# EasyEDA Pro project ProProject_PCB_PCB_小移动电源_2024-09-28_2024-12-17.epro

# Board PCB3
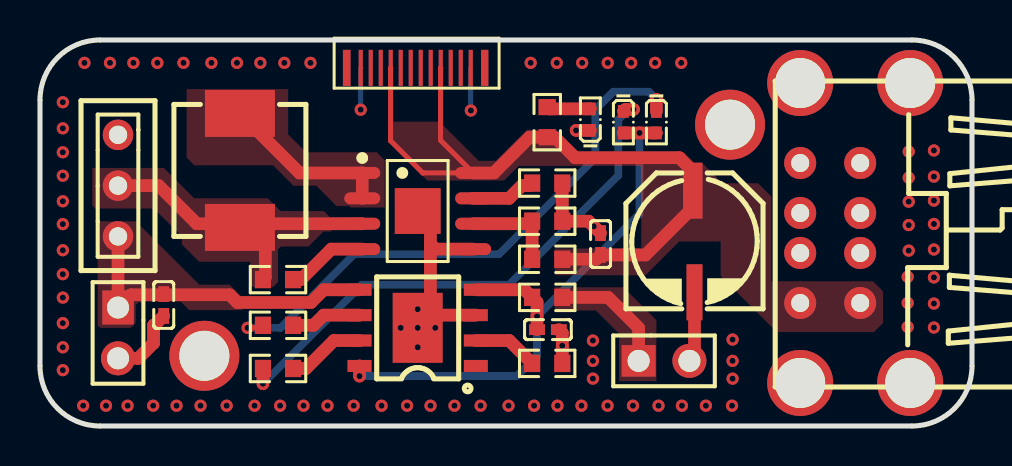
[diagram p0: board, top side]
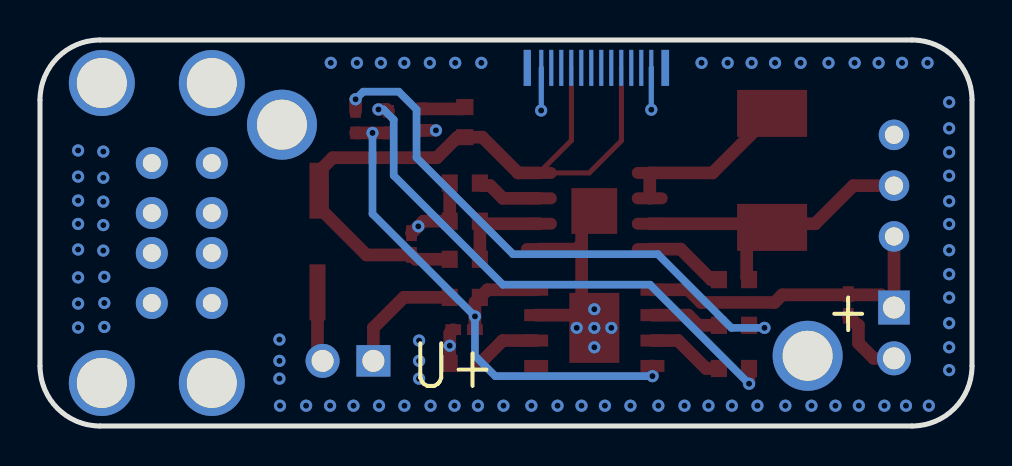
[diagram p1: board, bottom side, seen from below]

Outline 46.61 x 19.3 mm; copper layers: Top Layer, Bottom Layer. Coordinates in mm from the lower left corner of the outline.
Outline path: 0,16.3 0,3 arc(0.88,0.88) 3,0 43.61,0 arc(45.73,0.88) 46.61,3 46.61,16.3 arc(45.73,18.43) 43.61,19.3 3,19.3 arc(0.88,18.43) 0,16.3
Stack: Top Layer 0.035mm / Dielectric1 1.51mm FR4 er 4.5 / Bottom Layer 0.035mm

## Design rules (mm)
template: 自定义配置
spacing copperThickness1oz (default): track to track 0.102, other pairs 0.152 to 0.3
spacing copperThickness2oz: track to track 0.203, other pairs 0.152 to 0.3
track width copperThickness1oz (default): min 0.127, default 0.254, max 2.54
track width copperThickness2oz: min 0.203, default 0.254, max 2.54
differential pair differentialPair (default): width min 0.127, default 0.254, max 2.54; gap min 0.152, default 0.152
via viaSize (default): diameter min 0.5, default 0.61, max 10; hole min 0.3, default 0.305, max 6.299

## Placement (name value [footprint] x y rotation side)
C9  100uf  [CAP-D6.3×H5.5]  32.73 6.69 90 top
C10  22uf  [C0402]  28.03 9.1 270 top
C24  10U  [C0402]  25.4 4.82 180 top
C25  10U  [C0402]  6.19 6.05 270 top
ENABLE1  -  [SS-12D00-G4]  3.9 12.02 90 top
J1  HDR-M-2.54_1x2  [HDR-M-2.54_1X2]  3.9 4.65 270 top
J2  HDR-M-2.54_1x2  [HDR-M-2.54_1X2]  31.21 3.26 0 top
L2  3.3uH  [IND-SMD_L7.2-W6.6_GPSR07X0]  10 12.78 90 top
NOREF  -  [Pad_e117]  8.22 3.51 0 top
NOREF#2  -  [Pad_e109]  34.51 15.07 0 top
R1  0  [R0603]  25.36 6.43 0 top
R2  1k  [R0603]  11.9 5.04 180 top
R3  1k  [R0603]  11.9 2.88 180 top
R4  1k  [R0603]  25.36 3.13 180 top
R5  2k  [R0603]  25.36 15.2 270 top
R8  10k  [R0603]  11.9 7.32 0 top
R9  43k  [R0603]  25.36 12.15 0 top
R10  10k  [R0603]  25.36 10.24 180 top
R11  73k  [R0603]  25.36 8.34 0 top
U1  -  [TYPE-C 公头 夹板]  18.52 17.91 90 top
U2  双层USB母座 COPY  [双层USB母座]  40.77 9.65 90 top
U3  GBG-C281TBKT  [LED0402-RD]  29.17 15.2 270 top
U4  GBG-C281TBKT  [LED0402-RD]  30.83 15.2 270 top
U5  FP6276BXR-G1  [SOP-8_L4.9-W3.9-P1.27-LS6.0-BL-EP]  18.89 10.75 270 top
U6  GBG-C281TBKT  [LED0402-RD]  27.52 15.32 90 top
U11  TP4056  [ESOP-8_L4.9-W3.9-P1.27-LS6.0-BL-EP]  18.89 4.91 90 top

## Footprints (pads in the part's own frame, mm; a bottom-side part is the same pattern mirrored in y, then rotated)
C0402
  rect 0.79x0.54 smd: 1(-0.545,0) 2(0.545,0)
CAP-D6.3×H5.5
  rect 2.8x0.8 smd: 1(5.08,0) 2(0,0)
ESOP-8_L4.9-W3.9-P1.27-LS6.0-BL-EP
  rect 0.6x1.2 smd: 1(-1.905,-2.909) 2(-0.635,-2.909) 3(0.635,-2.909) 4(1.905,-2.909) 5(1.905,2.909) 6(0.635,2.909) 7(-0.635,2.909) 8(-1.905,2.909)
  rect 3.5x2.5 smd: 9(0,0)
HDR-M-2.54_1X2
  rect 1.7x1.575 hole 1.1: 1(-1.27,0)
  round 1.7 hole 1.1: 2(1.27,0)
IND-SMD_L7.2-W6.6_GPSR07X0
  rect 2.35x3.5 smd: 1(-2.85,0) 2(2.85,0)
LED0402-RD
  rect 0.636x0.54 smd: 1(-0.538,0) 2(0.538,0)
Pad_e109
  round 3.5 hole 2.5: 1(0,0)
Pad_e117
  round 3.5 hole 2.5: 1(0,0)
R0603
  rect 0.806x0.864 smd: 1(-0.753,0) 2(0.753,0)
SOP-8_L4.9-W3.9-P1.27-LS6.0-BL-EP
  oval 0.6x1.8 smd: 1(-1.905,-2.772) 2(-0.635,-2.772) 3(0.635,-2.772) 4(1.905,-2.772) 5(1.905,2.772) 6(0.635,2.772) 7(-0.635,2.772) 8(-1.905,2.772)
  rect 2.29x2.29 smd: 9(0,0)
SS-12D00-G4
  round 1.524 hole 0.914: 1(-2.54,0) 2(0,0) 3(2.54,0)
TYPE-C 公头 夹板
  rect 1.8x0.36 smd far side: 0(0,-3.725)
  rect 1.8x0.38 smd far side: 1(0,3.175)
  rect 1.8x0.36 smd: 2(0,-3.725)
  rect 1.8x0.38 smd: 3(0,3.175)
  rect 1.8x0.2 smd: A1(0,2.475) A2(0,1.975) A3(0,1.475) A4(0,0.975) A5(0,0.475) A6(0,-0.025) A7(0,-0.525) A8(0,-1.025) A9(0,-1.525) A10(0,-2.025) A11(0,-2.525) A12(0,-3.025)
  rect 1.8x0.2 smd far side: B1(0,-3.025) B2(0,-2.525) B3(0,-2.025) B4(0,-1.525) B5(0,-1.025) B6(0,-0.525) B7(0,-0.025) B8(0,0.475) B9(0,0.975) B10(0,1.475) B11(0,1.975) B12(0,2.475)
双层USB母座
  round 1.6 hole 0.9: 1(-3.5,2.75) 2(-3.5,-0.25) 3(3.5,2.75) 4(3.5,-0.25) 5(1,2.75) 6(-1,2.75) 7(1,-0.25) 8(-1,-0.25)
  round 3.3 hole 2.5: 9(-7.5,2.75) 10(7.5,2.75) 11(-7.5,-2.75) 12(7.5,-2.75)

## Nets
+5V: C9.1 C10.2 R5.2 R11.2 U1.A4 U1.A9 U1.B4 U1.B9 U2.1 U2.2 U5.8
GND: C9.2 C10.1 C24.1 C25.2 J1.2 J2.2 R4.1 R9.2 R10.1 U1.A1 U1.A12 U1.B1 U1.B12 U2.3 U2.4 U2.9 U2.10 U2.11 U2.12 U5.5 U5.9 U6.1 U11.1 U11.3 U11.9
VBUS: J2.1 R1.2
BAT: C25.1 ENABLE1.1 J1.1 U11.5
BAT-O: ENABLE1.2 L2.1 R8.1 U5.3
L2_2: L2.2 U5.1 U5.2
U3_1: R3.2 U3.1
U4_1: R2.2 U4.1
U4_2: C24.2 R1.1 U3.2 U4.2 U11.4 U11.8
U5_4: R8.2 U5.4
U5_6: R10.2 R11.1 U5.6
U5_7: R9.1 U5.7
U6_2: R5.1 U6.2
U11_2: R4.2 U11.2
U11_6: R2.1 U11.6
U11_7: R3.1 U11.7

Pads without a net: ENABLE1 3; NOREF 1; NOREF#2 1; U1 0 1 2 3 A2 A3 A5 A6 A7 A8 A10 A11 B2 B3 B5 B6 B7 B8 B10 B11; U2 5 6 7 8

## Via types
v1: diameter 0.61, hole 0.305, Top Layer to Bottom Layer, 95 vias

## Routing (per net, layer and track width the routed paths; a pad name or vN(x,y) marks a point on that pad's centre or on a via; arc(x,y) is an arc through that point)
+5V: length 36.3
  Top Layer w0.254: U1.A9 20.03,17.9 20.03,14.28 U5.8 19.14,12.66 17.53,14.27 17.53,17.9 U1.A4
  Top Layer w0.635: 32.48,11.77 C9.1 ; 32.48,11.77 32.48,12.91 31.97,13.42 26.76,13.42 25.74,14.44 R5.2 24.48,14.44 22.7,12.66 U5.8 ; 32.48,11.77 32.48,10.75 30.28,8.55 C10.2 27.82,8.34 R11.2
GND: length 28.3
  Top Layer w0.635: 32.48,3.26 32.73,3.51 C9.2 ; C10.1 v1(27.69,9.98) 27.43,10.24 R10.1 R9.2 ; 19.39,10.25 19.52,10.11 19.52,9.1 ; 19.52,9.1 19.78,8.85 U5.5 ; 19.52,9.1 19.52,5.54 ; 19.52,5.54 v1(18.89,4.91) ; 19.52,5.54 U11.3 ; J1.2 4.92,3.38 5.68,4.15 5.68,5.04 5.72,5.04 C25.2 ; U6.1 v1(26.81,14.78) ; C24.1 26.12,4.65 v1(26.12,4.01) R4.1
  Bottom Layer w0.254: U1.A1 16.04,17.91 v1(16.04,15.82) ; U1.A12 21.54,15.71 21.55,15.72 v1(21.55,15.78)
  vias: v1(1.14,16.19) v1(1.14,14.89) v1(1.14,13.69) v1(1.14,12.52) v1(1.14,11.24) v1(1.14,10.1) v1(1.14,8.79) v1(1.14,7.59) v1(1.14,6.42) v1(1.14,5.14) v1(1.14,3.94) v1(1.14,2.79) v1(2.22,18.16) v1(2.16,1.02) v1(3.3,1.02) v1(3.5,18.16) v1(4.38,1.02) v1(4.67,18.16) v1(5.66,1.02) v1(5.87,18.16) v1(6.83,1.02) v1(7.18,18.16) v1(8.03,1.02) v1(8.57,18.16) v1(9.33,1.02) v1(9.85,18.16) v1(10.73,1.02) v1(11.02,18.16) v1(12.01,1.02) v1(12.22,18.16) v1(13.18,1.02) v1(13.53,18.16) v1(14.38,1.02) v1(15.68,1.02) v1(17.08,1.02) v1(18.04,4.91) v1(18.36,1.02) v1(18.89,5.84) v1(18.89,3.94) v1(19.53,1.02) v1(19.77,4.91) v1(20.73,1.02) v1(22.03,1.02) v1(23.43,1.02) v1(24.54,18.16) v1(24.71,1.02) v1(25.84,18.16) v1(25.88,1.02) v1(27.11,18.16) v1(27.08,1.02) v1(27.65,4.27) v1(27.65,3.26) v1(27.65,2.37) v1(28.39,18.16) v1(28.38,1.02) v1(29.56,18.16) v1(29.65,1.02) v1(30.76,18.16) v1(30.93,1.02) v1(32.07,18.16) v1(32.1,1.02) v1(33.3,1.02) v1(34.64,4.32) v1(34.64,3.26) v1(34.64,2.37) v1(34.61,1.02) v1(43.44,13.72) v1(43.44,12.42) v1(43.44,11.22) v1(43.44,10.05) v1(43.44,8.77) v1(43.39,7.46) v1(43.39,6.15) v1(43.39,4.95) v1(44.7,13.78) v1(44.7,12.47) v1(44.7,11.27) v1(44.7,10.1) v1(44.7,8.83) v1(44.7,7.43) v1(44.7,6.12) v1(44.7,4.92)
VBUS: length 6.1
  Top Layer w0.635: J2.1 29.94,4.91 28.41,6.43 R1.2
BAT: length 16.3
  Top Layer w0.635: U11.5 14.19,6.81 13.55,6.18 9.87,6.18 9.49,6.56 4.54,6.56 J1.1 ENABLE1.1
BAT-O: length 15.9
  Top Layer w0.635: U5.3 10.18,10.12 ; 10.18,10.12 L2.1 ; 10.18,10.12 7.84,10.12 5.93,12.02 ENABLE1.2 ; R8.1 11.27,7.44 11.27,9.86
L2_2: length 8.6
  Top Layer w0.635: U5.2 U5.1 12.98,12.66 L2.2
U3_1: length 27.2
  Top Layer w0.254: R3.2 11.15,2.67
  Top Layer w0.635: v1(29.68,15.83) 29.27,15.83 U3.1 ; 11.15,2.67 v1(11.15,2.11)
  Bottom Layer w0.381: v1(11.15,2.11) 16.1,7.07 23.46,7.07 28.92,12.53 28.92,15.32 29.43,15.83 v1(29.68,15.83)
U4_1: length 28.3
  Top Layer w0.254: v1(10.38,4.91) 11.02,4.91 R2.2
  Top Layer w0.635: U4.1 v1(30.83,16.34)
  Bottom Layer w0.381: v1(10.38,4.91) 12.03,4.91 15.71,8.59 22.95,8.59 27.78,13.42 27.78,15.83 28.67,16.72 30.45,16.72 v1(30.83,16.34)
U4_2: length 29.4
  Top Layer w0.635: C24.2 v1(24.86,5.48) 24.86,6.19 R1.1 24.23,6.81 U11.4 ; U3.2 v1(29.98,14.66) U4.2 ; U11.8 v1(15.98,2.5)
  Bottom Layer w0.381: v1(15.98,2.5) 23.84,2.5 24.86,3.51 v1(24.86,5.48) 29.98,10.61 v1(29.98,14.66)
U5_4: length 4.1
  Top Layer w0.635: U5.4 14.57,8.85 13.05,7.32 R8.2
U5_6: length 4.9
  Top Layer w0.635: R11.1 R10.2 24.48,10.12 U5.6
U5_7: length 3.3
  Top Layer w0.635: U5.7 23.46,11.39 24.1,12.02 24.48,12.02 R9.1
U6_2: length 2.2
  Top Layer w0.635: 25.36,15.95 25.45,15.86 U6.2
U11_2: length 3.3
  Top Layer w0.635: U11.2 23.47,4.27 R4.2
U11_6: length 3.5
  Top Layer w0.635: R2.1 13.68,5.04 14.19,5.54 U11.6
U11_7: length 3.9
  Top Layer w0.635: R3.1 13.3,2.88 14.7,4.27 U11.7

## Copper pours and planes (outline as drawn; the poured copper is in the pictures)
+5V on Top Layer: 33.36,12.14 42.16,12.14 42.16,4.7 33.36,4.7
+5V on Top Layer: 17.44,15.22 34,15.22 34,7.54 17.44,7.54
GND on Top Layer: -4.06,24.26 49.78,24.26 49.78,-3.81 -4.06,-3.81
GND on Bottom Layer: -3.43,22.1 48.64,22.1 48.64,-3.81 -3.43,-3.81
VBUS on Top Layer: 25.75,6.94 30.83,6.94 30.83,2.24 25.75,2.24
BAT on Top Layer: 2.89,10.24 10.13,10.24 10.13,4.91 2.89,4.91
BAT-O on Top Layer: 2.62,12.91 14.57,12.91 14.57,6.94 2.62,6.94
L2_2 on Top Layer: 7.33,16.85 17.24,16.85 17.24,10.92 7.33,10.92

## Text on the board
Bottom Silkscreen Layer: + | U+

# Board PCB2
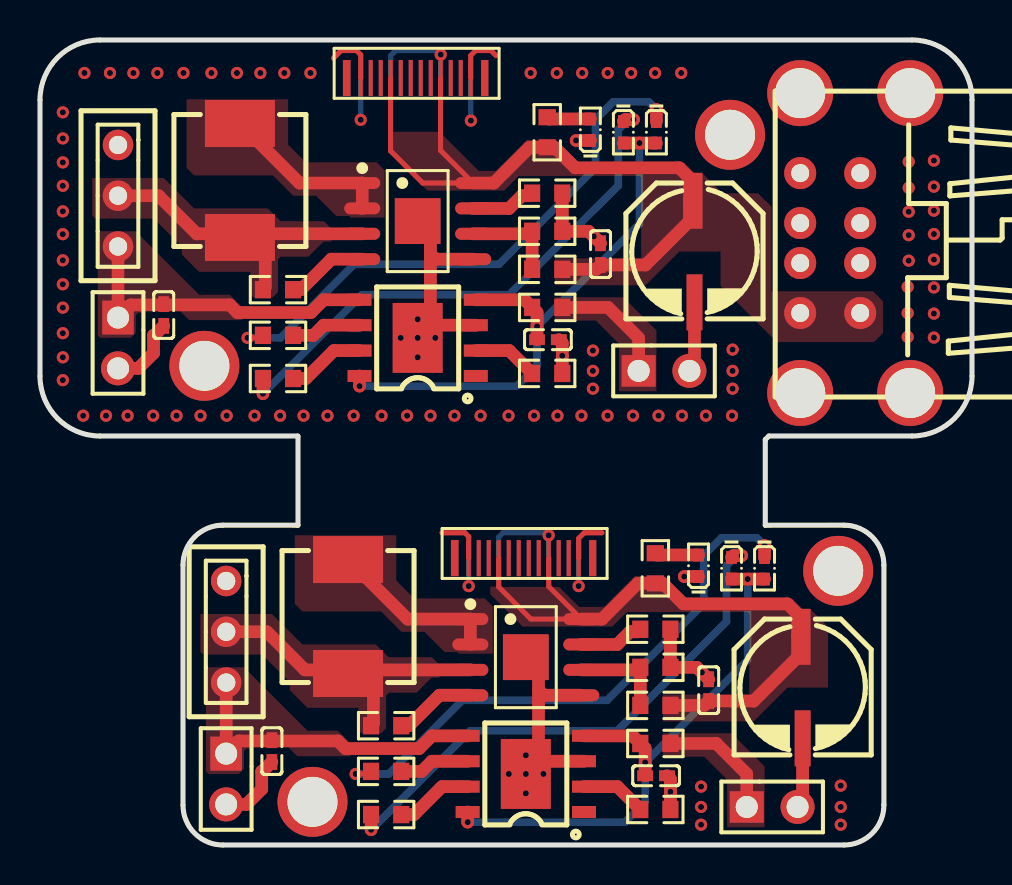
[diagram p2: board, top side]
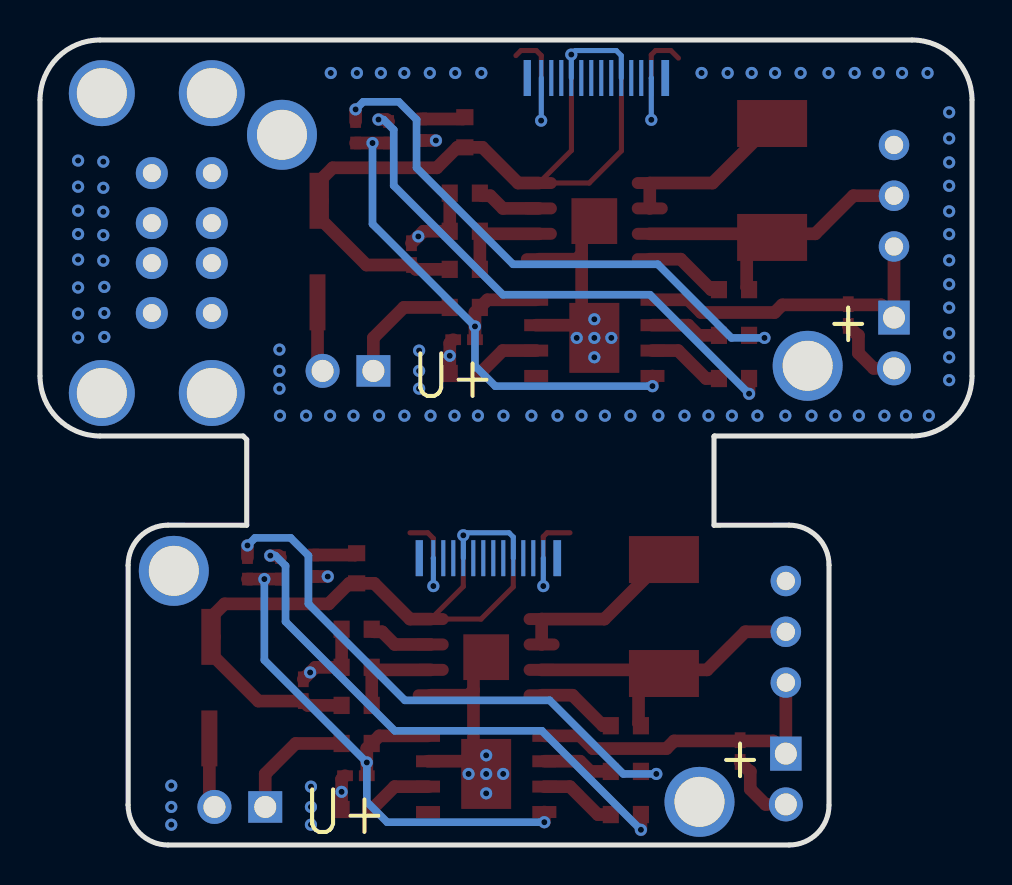
[diagram p3: board, bottom side, seen from below]

Outline 46.61 x 40.27 mm; copper layers: Top Layer, Bottom Layer. Coordinates in mm from the lower left corner of the outline.
Outline path: 0,37.27 0,23.46 arc(0.88,21.34) 3,20.46 12.88,20.46 12.9,20.44 12.9,16 9.15,16 arc(7.74,15.42) 7.15,14 7.15,2 arc(7.74,0.59) 9.15,0 40.2,0 arc(41.62,0.59) 42.2,2 42.2,14 arc(41.62,15.42) 40.2,16 36.27,16 36.27,20.28 36.45,20.46 43.61,20.46 arc(45.73,21.34) 46.61,23.46 46.61,37.27 arc(45.73,39.4) 43.61,40.27 3,40.27 arc(0.88,39.4) 0,37.27
Stack: Top Layer 0.035mm / Dielectric1 1.51mm FR4 er 4.5 / Bottom Layer 0.035mm

## Design rules (mm)
template: JLCPCB Capability(Two Layers Board)
spacing copperThickness1oz (default): track to track 0.102, other pairs 0.152 to 0.3
spacing copperThickness2oz: track to track 0.203, other pairs 0.152 to 0.3
track width copperThickness1oz (default): min 0.127, default 0.254, max 2.54
track width copperThickness2oz: min 0.203, default 0.254, max 2.54
differential pair differentialPair (default): width min 0.127, default 0.254, max 2.54; gap min 0.152, default 0.152
via viaSize (default): diameter min 0.5, default 0.61, max 10; hole min 0.3, default 0.305, max 6.3

## Placement (name value [footprint] x y rotation side)
C9  -  [CAP-D6.3×H5.5]  38.14 5.33 90 top
C9#2  -  [CAP-D6.3×H5.5]  32.73 27.15 90 top
C10  -  [C0402]  28.03 29.56 270 top
C10#2  -  [C0402]  33.44 7.75 270 top
C24  -  [C0402]  30.81 3.47 180 top
C24#2  -  [C0402]  25.4 25.28 180 top
C25  -  [C0402]  11.6 4.7 270 top
C25#2  -  [C0402]  6.19 26.51 270 top
ENABLE1  -  [SS-12D00-G4]  9.31 10.67 90 top
ENABLE1#2  -  [SS-12D00-G4]  3.9 32.48 90 top
J1  -  [HDR-M-2.54_1X2]  9.31 3.3 270 top
J1#2  -  [HDR-M-2.54_1X2]  3.9 25.12 270 top
J2  -  [HDR-M-2.54_1X2]  36.61 1.91 0 top
J2#2  -  [HDR-M-2.54_1X2]  31.21 23.72 0 top
L2  -  [IND-SMD_L7.2-W6.6_GPSR07X0]  15.41 11.43 90 top
L2#2  -  [IND-SMD_L7.2-W6.6_GPSR07X0]  10 33.24 90 top
NOREF  -  [Pad_e1738]  39.92 13.72 0 top
NOREF#2  -  [Pad_e976]  8.22 23.97 0 top
NOREF#3  -  [Pad_e1572]  13.63 2.16 0 top
NOREF#4  -  [Pad_e863]  34.51 35.53 0 top
R1  -  [R0603]  30.77 5.08 0 top
R1#2  -  [R0603]  25.36 26.89 0 top
R2  -  [R0603]  17.31 3.68 180 top
R2#2  -  [R0603]  11.9 25.5 180 top
R3  -  [R0603]  17.31 1.52 180 top
R3#2  -  [R0603]  11.9 23.34 180 top
R4  -  [R0603]  30.77 1.78 180 top
R4#2  -  [R0603]  25.36 23.59 180 top
R5  -  [R0603]  30.77 13.84 270 top
R5#2  -  [R0603]  25.36 35.66 270 top
R8  -  [R0603]  17.31 5.97 0 top
R8#2  -  [R0603]  11.9 27.78 0 top
R9  -  [R0603]  30.77 10.8 0 top
R9#2  -  [R0603]  25.36 32.61 0 top
R10  -  [R0603]  30.77 8.89 180 top
R10#2  -  [R0603]  25.36 30.7 180 top
R11  -  [R0603]  30.77 6.99 0 top
R11#2  -  [R0603]  25.36 28.8 0 top
U1  -  [TYPE-C 公头 夹板]  23.91 14.35 90 top
U1#2  -  [TYPE-C 公头 夹板]  18.51 38.37 90 top
U2  双层USB母座 COPY  [双层USB母座]  40.77 30.11 90 top
U3  -  [LED0402-RD]  34.58 13.84 270 top
U3#2  -  [LED0402-RD]  29.17 35.66 270 top
U4  -  [LED0402-RD]  36.23 13.84 270 top
U4#2  -  [LED0402-RD]  30.83 35.66 270 top
U5  -  [SOP-8_L4.9-W3.9-P1.27-LS6.0-BL-EP]  24.3 9.4 270 top
U5#2  -  [SOP-8_L4.9-W3.9-P1.27-LS6.0-BL-EP]  18.89 31.21 270 top
U6  -  [LED0402-RD]  32.93 13.97 90 top
U6#2  -  [LED0402-RD]  27.52 35.78 90 top
U11  -  [ESOP-8_L4.9-W3.9-P1.27-LS6.0-BL-EP]  24.3 3.56 90 top
U11#2  -  [ESOP-8_L4.9-W3.9-P1.27-LS6.0-BL-EP]  18.89 25.37 90 top

## Footprints (pads in the part's own frame, mm; a bottom-side part is the same pattern mirrored in y, then rotated)
C0402
  rect 0.79x0.54 smd: 1(-0.545,0) 2(0.545,0)
CAP-D6.3×H5.5
  rect 2.8x0.8 smd: 1(5.08,0) 2(0,0)
ESOP-8_L4.9-W3.9-P1.27-LS6.0-BL-EP
  rect 0.6x1.2 smd: 1(-1.905,-2.909) 2(-0.635,-2.909) 3(0.635,-2.909) 4(1.905,-2.909) 5(1.905,2.909) 6(0.635,2.909) 7(-0.635,2.909) 8(-1.905,2.909)
  rect 3.5x2.5 smd: 9(0,0)
HDR-M-2.54_1X2
  rect 1.7x1.575 hole 1.1: 1(-1.27,0)
  round 1.7 hole 1.1: 2(1.27,0)
IND-SMD_L7.2-W6.6_GPSR07X0
  rect 2.35x3.5 smd: 1(-2.85,0) 2(2.85,0)
LED0402-RD
  rect 0.636x0.54 smd: 1(-0.538,0) 2(0.538,0)
Pad_e863
  round 3.5 hole 2.5: 1(0,0)
Pad_e976
  round 3.5 hole 2.5: 1(0,0)
Pad_e1572
  round 3.5 hole 2.5: 1(0,0)
Pad_e1738
  round 3.5 hole 2.5: 1(0,0)
R0603
  rect 0.806x0.864 smd: 1(-0.753,0) 2(0.753,0)
SOP-8_L4.9-W3.9-P1.27-LS6.0-BL-EP
  oval 0.6x1.8 smd: 1(-1.905,-2.772) 2(-0.635,-2.772) 3(0.635,-2.772) 4(1.905,-2.772) 5(1.905,2.772) 6(0.635,2.772) 7(-0.635,2.772) 8(-1.905,2.772)
  rect 2.29x2.29 smd: 9(0,0)
SS-12D00-G4
  round 1.524 hole 0.914: 1(-2.54,0) 2(0,0) 3(2.54,0)
TYPE-C 公头 夹板
  rect 1.8x0.36 smd far side: 0(0,-3.725)
  rect 1.8x0.38 smd far side: 1(0,3.175)
  rect 1.8x0.36 smd: 2(0,-3.725)
  rect 1.8x0.38 smd: 3(0,3.175)
  rect 1.8x0.2 smd: A1(0,2.475) A2(0,1.975) A3(0,1.475) A4(0,0.975) A5(0,0.475) A6(0,-0.025) A7(0,-0.525) A8(0,-1.025) A9(0,-1.525) A10(0,-2.025) A11(0,-2.525) A12(0,-3.025)
  rect 1.8x0.2 smd far side: B1(0,-3.025) B2(0,-2.525) B3(0,-2.025) B4(0,-1.525) B5(0,-1.025) B6(0,-0.525) B7(0,-0.025) B8(0,0.475) B9(0,0.975) B10(0,1.475) B11(0,1.975) B12(0,2.475)
双层USB母座
  round 1.6 hole 0.9: 1(-3.5,2.75) 2(-3.5,-0.25) 3(3.5,2.75) 4(3.5,-0.25) 5(1,2.75) 6(-1,2.75) 7(1,-0.25) 8(-1,-0.25)
  round 3.3 hole 2.5: 9(-7.5,2.75) 10(7.5,2.75) 11(-7.5,-2.75) 12(7.5,-2.75)

## Nets
+5V: C9.1 C9#2.1 C10.2 C10#2.2 R5.2 R5#2.2 R11.2 R11#2.2 U1.A4 U1.A9 U1.B4 U1.B9 U1#2.A4 U1#2.A9 U1#2.B4 U1#2.B9 U2.1 U2.2 U5.8 U5#2.8
GND: C9.2 C9#2.2 C10.1 C10#2.1 C24.1 C24#2.1 C25.2 C25#2.2 J1.2 J1#2.2 J2.2 J2#2.2 R4.1 R4#2.1 R9.2 R9#2.2 R10.1 R10#2.1 U1.A1 U1.A12 U1.B1 U1.B12 U1#2.A1 U1#2.A12 U1#2.B1 U1#2.B12 U2.3 U2.4 U2.9 U2.10 U2.11 U2.12 U5.5 U5.9 U5#2.5 U5#2.9 U6.1 U6#2.1 U11.1 U11.3 U11.9 U11#2.1 U11#2.3 U11#2.9
VBUS: J2.1 J2#2.1 R1.2 R1#2.2
BAT: C25.1 C25#2.1 ENABLE1.1 ENABLE1#2.1 J1.1 J1#2.1 U11.5 U11#2.5
BAT-O: ENABLE1.2 ENABLE1#2.2 L2.1 L2#2.1 R8.1 R8#2.1 U5.3 U5#2.3
L2_2: L2.2 L2#2.2 U5.1 U5.2 U5#2.1 U5#2.2
U3_1: R3.2 R3#2.2 U3.1 U3#2.1
U4_1: R2.2 R2#2.2 U4.1 U4#2.1
U4_2: C24.2 C24#2.2 R1.1 R1#2.1 U3.2 U3#2.2 U4.2 U4#2.2 U11.4 U11.8 U11#2.4 U11#2.8
U5_4: R8.2 R8#2.2 U5.4 U5#2.4
U5_6: R10.2 R10#2.2 R11.1 R11#2.1 U5.6 U5#2.6
U5_7: R9.1 R9#2.1 U5.7 U5#2.7
U6_2: R5.1 R5#2.1 U6.2 U6#2.2
U11_2: R4.2 R4#2.2 U11.2 U11#2.2
U11_6: R2.1 R2#2.1 U11.6 U11#2.6
U11_7: R3.1 R3#2.1 U11.7 U11#2.7

Pads without a net: ENABLE1 3; ENABLE1#2 3; NOREF 1; NOREF#2 1; NOREF#3 1; NOREF#4 1; U1 0 1 2 3 A2 A3 A5 A6 A7 A8 A10 A11 B2 B3 B5 B6 B7 B8 B10 B11; U1#2 0 1 2 3 A2 A3 A5 A6 A7 A8 A10 A11 B2 B3 B5 B6 B7 B8 B10 B11; U2 5 6 7 8

## Via types
v1: diameter 0.61, hole 0.305, Top Layer to Bottom Layer, 120 vias

## Routing (per net, layer and track width the routed paths; a pad name or vN(x,y) marks a point on that pad's centre or on a via; arc(x,y) is an arc through that point)
+5V: length 78.1
  Top Layer w0.254: 17.53,38.36 17.53,34.73 19.14,33.12 U5#2.8 20.03,34.75 20.03,38.36 ; U1.A4 22.94,12.91 24.55,11.3 U5.8 25.44,12.93 U1.A9
  Top Layer w0.635: R11.2 33.22,6.99 C10#2.2 35.69,7.2 37.88,9.4 37.88,10.41 ; U5.8 28.11,11.3 29.89,13.09 R5.2 31.15,13.09 32.17,12.07 37.38,12.07 37.88,11.56 37.88,10.41 ; 32.48,32.23 C9#2.1 ; 32.48,32.23 32.48,31.21 30.28,29.02 C10.2 27.81,28.8 R11#2.2 ; 32.48,32.23 32.48,33.37 31.97,33.88 26.76,33.88 25.74,34.9 R5#2.2 24.48,34.9 22.7,33.12 U5#2.8 ; 37.88,10.41 C9.1
  Bottom Layer w0.254: U1.A4 22.94,15.41 23.15,15.62 25.31,15.62 v1(25.44,15.49) 25.44,14.35 ; U1#2.A4 17.54,39.49 17.79,39.75 19.84,39.75 v1(20.04,39.54) U1#2.A9
GND: length 65.2
  Top Layer w0.254: U1.A1 21.44,15.43 21.25,15.62 20.1,15.62 ; U1#2.A12 21.54,39.49 21.79,39.75 22.55,39.75 22.81,39.49 ; 14.68,39.37 15.06,39.75 15.82,39.75 16.04,39.53 U1#2.A1 ; U1.A12 26.94,15.34 27.22,15.62 28.11,15.62
  Top Layer w0.635: R4.1 v1(31.53,2.66) 31.53,3.3 C24.1 ; 19.52,29.56 19.52,26.01 ; 19.52,29.56 19.78,29.31 U5#2.5 ; 19.52,29.56 19.52,30.58 19.39,30.71 ; 19.52,26.01 v1(18.89,25.37) ; 19.52,26.01 U11#2.3 ; R9.2 R10.1 32.84,8.89 v1(33.1,8.63) C10#2.1 ; 24.8,8.9 24.93,8.76 24.93,7.75 ; 25.95,25.28 26.12,25.11 v1(26.12,24.48) R4#2.1 ; U5.5 25.19,7.49 24.93,7.75 ; C25.2 11.12,3.68 11.09,3.68 11.09,2.79 10.33,2.03 J1.2 ; R9#2.2 R10#2.1 27.43,30.7 v1(27.69,30.45) C10.1 ; J1#2.2 4.92,23.85 5.68,24.61 5.68,25.5 5.72,25.5 C25#2.2 ; C9#2.2 32.73,23.97 J2#2.2 ; J2.2 38.14,2.16 C9.2 ; U11.3 24.93,4.19 ; 24.93,4.19 24.93,7.75 ; 24.93,4.19 v1(24.3,3.56) ; U6#2.1 v1(26.81,35.25) ; U6.1 v1(32.22,13.43)
  Bottom Layer w0.254: v1(26.94,12.95) 26.94,14.35 U1.A12 ; U1.A1 v1(21.44,12.95) ; U1#2.A12 21.54,36.17 21.55,36.18 v1(21.55,36.24) ; U1#2.A1 16.04,38.37 v1(16.04,36.28)
  vias: v1(1.14,36.65) v1(1.14,35.35) v1(1.14,34.15) v1(1.14,32.98) v1(1.14,31.7) v1(1.14,30.56) v1(1.14,29.25) v1(1.14,28.05) v1(1.14,26.88) v1(1.14,25.61) v1(1.14,24.4) v1(1.14,23.26) v1(2.16,21.48) v1(2.22,38.62) v1(3.3,21.48) v1(3.5,38.62) v1(4.38,21.48) v1(4.67,38.62) v1(5.66,21.48) v1(5.87,38.62) v1(6.83,21.48) v1(7.18,38.62) v1(8.03,21.48) v1(8.57,38.62) v1(9.33,21.48) v1(9.85,38.62) v1(10.73,21.48) v1(11.02,38.62) v1(12.01,21.48) v1(12.22,38.62) v1(13.18,21.48) v1(13.53,38.62) v1(14.38,21.48) v1(15.68,21.48) v1(17.08,21.48) v1(18.04,25.37) v1(18.36,21.48) v1(18.89,26.3) v1(18.89,24.4) v1(19.53,21.48) v1(19.77,25.37) v1(20.73,21.48) v1(22.03,21.48) v1(23.43,21.48) v1(23.45,3.56) v1(24.3,4.49) v1(24.3,2.59) v1(24.54,38.62) v1(24.71,21.48) v1(25.18,3.56) v1(25.84,38.62) v1(25.88,21.48) v1(27.08,21.48) v1(27.11,38.62) v1(27.65,24.74) v1(27.65,23.72) v1(27.65,22.83) v1(28.39,38.62) v1(28.38,21.48) v1(29.56,38.62) v1(29.65,21.48) v1(30.76,38.62) v1(30.93,21.48) v1(32.07,38.62) v1(32.1,21.48) v1(33.06,2.92) v1(33.06,1.91) v1(33.06,1.02) v1(33.3,21.48) v1(34.64,24.79) v1(34.64,23.72) v1(34.64,22.83) v1(34.61,21.48) v1(40.04,2.97) v1(40.04,1.91) v1(40.04,1.02) v1(43.44,34.19) v1(43.44,32.88) v1(43.44,31.68) v1(43.44,30.51) v1(43.44,29.23) v1(43.39,27.92) v1(43.39,26.61) v1(43.39,25.42) v1(44.7,34.24) v1(44.7,32.94) v1(44.7,31.74) v1(44.7,30.57) v1(44.7,29.29) v1(44.7,27.89) v1(44.7,26.59) v1(44.7,25.39)
VBUS: length 12.2
  Top Layer w0.635: R1.2 33.82,5.08 35.34,3.56 J2.1 ; R1#2.2 28.41,26.89 29.94,25.37 J2#2.1
BAT: length 32.6
  Top Layer w0.635: ENABLE1.1 J1.1 9.94,5.21 14.9,5.21 15.28,4.83 18.96,4.83 19.6,5.46 U11.5 ; U11#2.5 14.19,27.28 13.55,26.64 9.87,26.64 9.49,27.02 4.54,27.02 J1#2.1 ENABLE1#2.1
BAT-O: length 31.7
  Top Layer w0.635: U5#2.3 10.18,30.58 ; 10.18,30.58 L2#2.1 ; 10.18,30.58 7.84,30.58 5.93,32.48 ENABLE1#2.2 ; ENABLE1.2 11.34,10.67 13.25,8.76 15.59,8.76 ; R8.1 16.68,6.09 16.68,8.51 ; 15.59,8.76 L2.1 ; 15.59,8.76 U5.3 ; 11.15,27.78 11.27,27.9 11.27,30.32
L2_2: length 17.2
  Top Layer w0.635: L2.2 18.38,11.3 U5.1 U5.2 ; U5#2.2 U5#2.1 12.97,33.12 L2#2.2
U3_1: length 54.3
  Top Layer w0.254: 11.15,23.34 11.15,23.13 ; R3.2 16.56,1.32
  Top Layer w0.635: 11.15,23.13 v1(11.15,22.58) ; 16.56,1.32 v1(16.56,0.76) ; v1(29.68,36.29) 29.27,36.29 U3#2.1 ; U3.1 34.68,14.48 v1(35.09,14.48)
  Bottom Layer w0.381: v1(11.15,22.58) 16.1,27.53 23.46,27.53 28.92,32.99 28.92,35.78 29.43,36.29 v1(29.68,36.29) ; v1(35.09,14.48) 34.84,14.48 34.33,13.97 34.33,11.18 28.87,5.72 21.51,5.72 v1(16.56,0.76)
U4_1: length 56.7
  Top Layer w0.254: R2.2 16.43,3.56 v1(15.79,3.56) ; v1(10.38,25.37) 11.02,25.37 11.15,25.5
  Top Layer w0.635: U4#2.1 v1(30.83,36.8) ; U4.1 v1(36.23,14.99)
  Bottom Layer w0.381: v1(15.79,3.56) 17.44,3.56 21.12,7.24 28.36,7.24 33.19,12.07 33.19,14.48 34.07,15.37 35.85,15.37 v1(36.23,14.99) ; v1(30.83,36.8) 30.44,37.18 28.67,37.18 27.78,36.29 27.78,33.88 22.95,29.05 15.71,29.05 12.03,25.37 v1(10.38,25.37)
U4_2: length 58.8
  Top Layer w0.635: 30.26,3.47 v1(30.26,4.13) 30.26,4.83 R1.1 29.64,5.46 U11.4 ; U4.2 v1(35.39,13.31) U3.2 ; U11#2.4 24.23,27.28 R1#2.1 24.86,26.65 v1(24.86,25.95) C24#2.2 ; 30.83,35.12 v1(29.98,35.12) 29.17,35.12 ; U11.8 v1(21.39,1.14) ; U11#2.8 v1(15.98,22.96)
  Bottom Layer w0.381: v1(35.39,13.31) 35.39,9.25 v1(30.26,4.13) 30.26,2.16 29.25,1.14 v1(21.39,1.14) ; v1(29.98,35.12) 29.98,31.07 v1(24.86,25.95) 24.86,23.97 23.84,22.96 v1(15.98,22.96)
U5_4: length 8.2
  Top Layer w0.635: R8.2 18.45,5.97 19.98,7.49 U5.4 ; U5#2.4 14.57,29.31 13.05,27.78 R8#2.2
U5_6: length 9.8
  Top Layer w0.635: U5.6 29.89,8.76 R10.2 R11.1 ; U5#2.6 24.48,30.58 R10#2.2 R11#2.1
U5_7: length 6.5
  Top Layer w0.635: R9.1 29.89,10.67 29.5,10.67 28.87,10.03 U5.7 ; R9#2.1 24.48,32.48 24.09,32.48 23.46,31.85 U5#2.7
U6_2: length 4.4
  Top Layer w0.635: R5#2.1 25.45,36.32 U6#2.2 ; U6.2 30.86,14.51 R5.1
U11_2: length 6.6
  Top Layer w0.635: R4.2 28.88,2.92 U11.2 ; R4#2.2 23.47,24.74 U11#2.2
U11_6: length 7.1
  Top Layer w0.635: U11.6 19.6,4.19 19.09,3.68 R2.1 ; U11#2.6 14.19,26.01 13.68,25.5 R2#2.1
U11_7: length 7.8
  Top Layer w0.635: U11#2.7 14.7,24.74 13.3,23.34 R3#2.1 ; U11.7 20.1,2.92 18.71,1.52 R3.1

## Copper pours and planes (outline as drawn; the poured copper is in the pictures)
+5V on Top Layer: 33.36,32.6 42.16,32.6 42.16,25.16 33.36,25.16
+5V on Top Layer: 17.44,35.68 34,35.68 34,28 17.44,28
+5V on Top Layer: 22.52,13.46 39.41,13.46 39.41,6.18 22.52,6.18
GND on Top Layer: -4.06,44.72 49.78,44.72 49.78,16.65 -4.06,16.65
GND on Top Layer: 4.74,18.16 44.74,18.16 44.74,-1.91 4.74,-1.91
GND on Bottom Layer: 5.25,18.92 43.85,18.92 43.85,-1.4 5.25,-1.4
GND on Bottom Layer: -3.43,42.56 48.64,42.56 48.64,16.65 -3.43,16.65
VBUS on Top Layer: 31.15,5.59 36.23,5.59 36.23,0.89 31.15,0.89
VBUS on Top Layer: 25.75,27.4 30.83,27.4 30.83,22.7 25.75,22.7
BAT on Top Layer: 8.29,8.89 15.53,8.89 15.53,3.56 8.29,3.56
BAT on Top Layer: 2.89,30.7 10.12,30.7 10.12,25.37 2.89,25.37
BAT-O on Top Layer: 2.62,33.37 14.57,33.37 14.57,27.4 2.62,27.4
BAT-O on Top Layer: 8.02,11.56 19.98,11.56 19.98,5.59 8.02,5.59
L2_2 on Top Layer: 7.33,37.31 17.24,37.31 17.24,31.39 7.33,31.39
L2_2 on Top Layer: 12.74,15.49 22.64,15.49 22.64,9.57 12.74,9.57

## Text on the board
Bottom Silkscreen Layer: + | U+

# Board PCB_PCB_小移动电源_2024-09-28
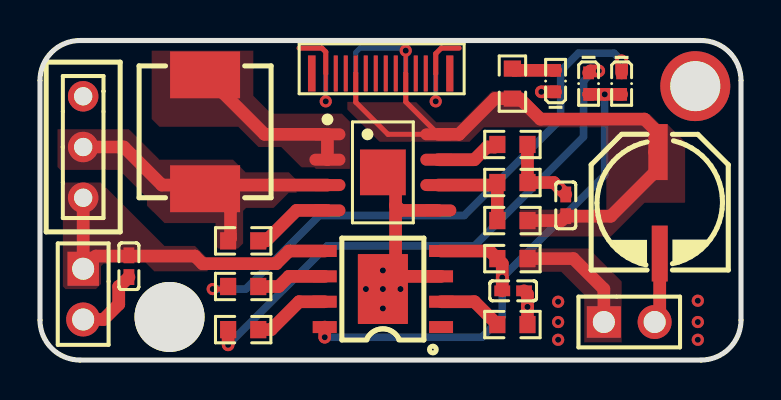
[diagram p4: board, top side]
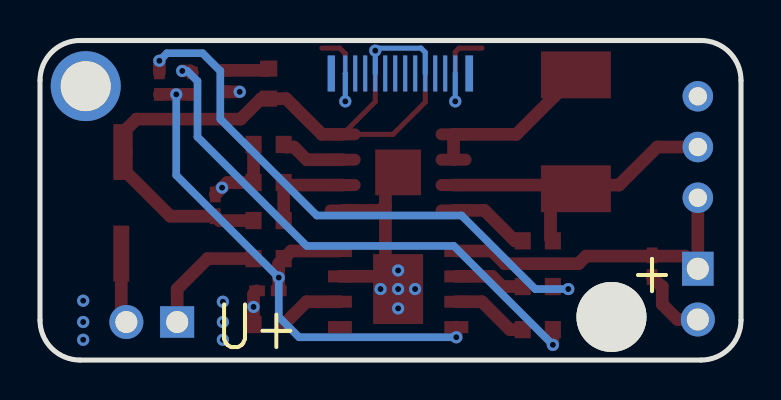
[diagram p5: board, bottom side, seen from below]

Outline 35.05 x 16 mm; copper layers: Top Layer, Bottom Layer. Coordinates in mm from the lower left corner of the outline.
Outline path: 0,14 0,2 arc(0.59,0.59) 2,0 33.05,0 arc(34.47,0.59) 35.05,2 35.05,14 arc(34.47,15.42) 33.05,16 2,16 arc(0.59,15.42) 0,14
Stack: Top Layer 0.035mm / Dielectric1 1.51mm FR4 er 4.5 / Bottom Layer 0.035mm

## Design rules (mm)
template: 用户自定义配置
spacing Default (default): track to track 0.152, other pairs 0 to 0.152
track width Default (default): min 0.254, default 0.254, max 25.4
differential pair differentialPair (default): width min 0.127, default 0.254, max 2.54; gap min 0.152, default 0.152
via Default (default): diameter min 0.61, default 0.61, max 100.025; hole min 0.305, default 0.305, max 59.995

## Placement (name value [footprint] x y rotation side)
C9  100uf  [CAP-D6.3×H5.5]  30.99 5.33 90 top
C10  22uf  [C0402]  26.29 7.75 270 top
C24  10U  [C0402]  23.66 3.47 180 top
C25  10U  [C0402]  4.45 4.7 270 top
ENABLE1  -  [SS-12D00-G4]  2.16 10.67 90 top
J1  HDR-M-2.54_1x2  [HDR-M-2.54_1X2]  2.16 3.3 270 top
J2  HDR-M-2.54_1x2  [HDR-M-2.54_1X2]  29.46 1.91 0 top
L2  3.3uH  [IND-SMD_L7.2-W6.6_GPSR07X0]  8.25 11.43 90 top
NOREF  -  [Pad_e54]  32.77 13.72 0 top
NOREF#2  -  [Pad_e52]  6.48 2.16 0 top
R1  0  [R0603]  23.62 5.08 0 top
R2  1k  [R0603]  10.16 3.68 180 top
R3  1k  [R0603]  10.16 1.52 180 top
R4  1k  [R0603]  23.62 1.78 180 top
R5  2k  [R0603]  23.62 13.84 270 top
R8  10k  [R0603]  10.16 5.97 0 top
R9  43k  [R0603]  23.62 10.79 0 top
R10  10k  [R0603]  23.62 8.89 180 top
R11  73k  [R0603]  23.62 6.98 0 top
U1  -  [TYPE-C 公头 夹板]  16.76 14.35 90 top
U3  GBG-C281TBKT  [LED0402-RD]  27.43 13.84 270 top
U4  GBG-C281TBKT  [LED0402-RD]  29.08 13.84 270 top
U5  FP6276BXR-G1  [SOP-8_L4.9-W3.9-P1.27-LS6.0-BL-EP]  17.14 9.4 270 top
U6  GBG-C281TBKT  [LED0402-RD]  25.78 13.97 90 top
U11  TP4056  [ESOP-8_L4.9-W3.9-P1.27-LS6.0-BL-EP]  17.14 3.56 90 top

## Footprints (pads in the part's own frame, mm; a bottom-side part is the same pattern mirrored in y, then rotated)
C0402
  rect 0.79x0.54 smd: 1(-0.545,0) 2(0.545,0)
CAP-D6.3×H5.5
  rect 2.8x0.8 smd: 1(5.08,0) 2(0,0)
ESOP-8_L4.9-W3.9-P1.27-LS6.0-BL-EP
  rect 0.6x1.2 smd: 1(-1.905,-2.909) 2(-0.635,-2.909) 3(0.635,-2.909) 4(1.905,-2.909) 5(1.905,2.909) 6(0.635,2.909) 7(-0.635,2.909) 8(-1.905,2.909)
  rect 3.5x2.5 smd: 9(0,0)
HDR-M-2.54_1X2
  rect 1.7x1.575 hole 1.1: 1(-1.27,0)
  round 1.7 hole 1.1: 2(1.27,0)
IND-SMD_L7.2-W6.6_GPSR07X0
  rect 2.35x3.5 smd: 1(-2.85,0) 2(2.85,0)
LED0402-RD
  rect 0.636x0.54 smd: 1(-0.538,0) 2(0.538,0)
Pad_e52
  round 3.5 hole 3.5x2.5: 1(0,0)
Pad_e54
  round 3.5 hole 2.5: 1(0,0)
R0603
  rect 0.806x0.864 smd: 1(-0.753,0) 2(0.753,0)
SOP-8_L4.9-W3.9-P1.27-LS6.0-BL-EP
  oval 0.6x1.8 smd: 1(-1.905,-2.772) 2(-0.635,-2.772) 3(0.635,-2.772) 4(1.905,-2.772) 5(1.905,2.772) 6(0.635,2.772) 7(-0.635,2.772) 8(-1.905,2.772)
  rect 2.29x2.29 smd: 9(0,0)
SS-12D00-G4
  round 1.524 hole 0.914: 1(-2.54,0) 2(0,0) 3(2.54,0)
TYPE-C 公头 夹板
  rect 1.8x0.36 smd far side: 0(0,-3.725)
  rect 1.8x0.38 smd far side: 1(0,3.175)
  rect 1.8x0.36 smd: 2(0,-3.725)
  rect 1.8x0.38 smd: 3(0,3.175)
  rect 1.8x0.2 smd: A1(0,2.475) A2(0,1.975) A3(0,1.475) A4(0,0.975) A5(0,0.475) A6(0,-0.025) A7(0,-0.525) A8(0,-1.025) A9(0,-1.525) A10(0,-2.025) A11(0,-2.525) A12(0,-3.025)
  rect 1.8x0.2 smd far side: B1(0,-3.025) B2(0,-2.525) B3(0,-2.025) B4(0,-1.525) B5(0,-1.025) B6(0,-0.525) B7(0,-0.025) B8(0,0.475) B9(0,0.975) B10(0,1.475) B11(0,1.975) B12(0,2.475)

## Nets
+5V: C9.1 C10.2 R5.2 R11.2 U1.A4 U1.A9 U1.B4 U1.B9 U5.8
GND: C9.2 C10.1 C24.1 C25.2 J1.2 J2.2 R4.1 R9.2 R10.1 U1.A1 U1.A12 U1.B1 U1.B12 U5.5 U5.9 U6.1 U11.1 U11.3 U11.9
VBUS: J2.1 R1.2
BAT: C25.1 ENABLE1.1 J1.1 U11.5
BAT-O: ENABLE1.2 L2.1 R8.1 U5.3
L2_2: L2.2 U5.1 U5.2
U3_1: R3.2 U3.1
U4_1: R2.2 U4.1
U4_2: C24.2 R1.1 U3.2 U4.2 U11.4 U11.8
U5_4: R8.2 U5.4
U5_6: R10.2 R11.1 U5.6
U5_7: R9.1 U5.7
U6_2: R5.1 U6.2
U11_2: R4.2 U11.2
U11_6: R2.1 U11.6
U11_7: R3.1 U11.7

Pads without a net: ENABLE1 3; NOREF 1; NOREF#2 1; U1 0 1 2 3 A2 A3 A5 A6 A7 A8 A10 A11 B2 B3 B5 B6 B7 B8 B10 B11

## Via types
v1: diameter 0.61, hole 0.305, Top Layer to Bottom Layer, 24 vias

## Routing (per net, layer and track width the routed paths; a pad name or vN(x,y) marks a point on that pad's centre or on a via; arc(x,y) is an arc through that point)
+5V: length 36.8
  Top Layer w0.254: U1.A4 15.79,12.91 17.4,11.3 U5.8 18.29,12.93 U1.A9
  Top Layer w0.635: R11.2 26.07,6.98 C10.2 28.54,7.2 30.73,9.4 30.73,10.41 ; 30.73,10.41 30.73,11.56 30.23,12.06 25.02,12.06 23.99,13.09 R5.2 22.74,13.09 20.95,11.3 U5.8 ; 30.73,10.41 C9.1
  Bottom Layer w0.254: U1.A4 15.79,15.41 16,15.62 18.16,15.62 v1(18.29,15.49) 18.29,14.35
GND: length 31.5
  Top Layer w0.254: 12.95,15.62 14.1,15.62 14.29,15.43 U1.A1 ; 20.95,15.62 20.07,15.62 19.79,15.34 U1.A12
  Top Layer w0.635: 17.78,4.19 v1(17.14,3.56) ; 17.78,4.19 17.78,7.75 ; 17.78,4.19 U11.3 ; 25.78,13.43 v1(25.07,13.43) ; 17.78,7.75 18.03,7.49 U5.5 ; 17.78,7.75 17.78,8.76 17.64,8.9 ; J1.2 3.17,2.03 3.94,2.79 3.94,3.68 3.97,3.68 C25.2 ; 26.29,8.29 v1(25.95,8.63) 25.69,8.89 R10.1 R9.2 ; C24.1 24.38,3.29 v1(24.38,2.66) R4.1 ; C9.2 30.99,2.16 J2.2
  Bottom Layer w0.254: v1(19.79,12.95) 19.79,14.35 U1.A12 ; U1.A1 v1(14.29,12.95)
  vias: v1(16.3,3.56) v1(17.14,4.49) v1(17.14,2.58) v1(18.03,3.56) v1(25.91,2.92) v1(25.91,1.91) v1(25.91,1.02) v1(32.89,2.97) v1(32.89,1.91) v1(32.89,1.02)
VBUS: length 6.1
  Top Layer w0.635: 28.19,1.91 28.19,3.56 26.67,5.08 R1.2
BAT: length 16.3
  Top Layer w0.635: U11.5 12.45,5.46 11.81,4.83 8.13,4.83 7.75,5.21 2.79,5.21 J1.1 ENABLE1.1
BAT-O: length 15.9
  Top Layer w0.635: U5.3 8.44,8.76 ; 8.44,8.76 6.1,8.76 4.19,10.67 ENABLE1.2 ; 8.44,8.76 L2.1 ; 9.52,8.51 9.52,6.09 R8.1
L2_2: length 8.6
  Top Layer w0.635: L2.2 11.23,11.3 U5.1 U5.2
U3_1: length 27.2
  Top Layer w0.254: R3.2 9.41,1.32
  Top Layer w0.635: v1(27.94,14.48) 27.53,14.48 U3.1 ; 9.41,1.32 v1(9.41,0.76)
  Bottom Layer w0.381: v1(27.94,14.48) 27.69,14.48 27.18,13.97 27.18,11.18 21.72,5.71 14.36,5.71 v1(9.41,0.76)
U4_1: length 28.3
  Top Layer w0.254: v1(8.64,3.56) 9.28,3.56 R2.2
  Top Layer w0.635: U4.1 v1(29.08,14.99)
  Bottom Layer w0.381: v1(29.08,14.99) 28.7,15.37 26.92,15.37 26.03,14.48 26.03,12.06 21.21,7.24 13.97,7.24 10.29,3.56 v1(8.64,3.56)
U4_2: length 29.4
  Top Layer w0.635: U11.4 22.49,5.46 R1.1 23.11,4.83 v1(23.11,4.13) C24.2 ; U3.2 v1(28.24,13.3) U4.2 ; U11.8 v1(14.24,1.14)
  Bottom Layer w0.381: v1(14.24,1.14) 22.1,1.14 23.11,2.16 v1(23.11,4.13) 28.24,9.25 v1(28.24,13.3)
U5_4: length 4.1
  Top Layer w0.635: U5.4 12.83,7.49 11.3,5.97 R8.2
U5_6: length 4.9
  Top Layer w0.635: U5.6 22.74,8.76 R10.2 R11.1
U5_7: length 3.3
  Top Layer w0.635: R9.1 22.74,10.67 22.35,10.67 21.72,10.03 U5.7
U6_2: length 2.2
  Top Layer w0.635: R5.1 23.71,14.51 U6.2
U11_2: length 3.3
  Top Layer w0.635: R4.2 21.73,2.92 U11.2
U11_6: length 3.5
  Top Layer w0.635: U11.6 12.45,4.19 11.94,3.68 R2.1
U11_7: length 3.9
  Top Layer w0.635: R3.1 11.56,1.52 12.95,2.92 U11.7

## Copper pours and planes (outline as drawn; the poured copper is in the pictures)
+5V on Top Layer: 15.37,13.46 32.26,13.46 32.26,6.18 15.37,6.18
GND on Top Layer: -2.41,18.16 37.59,18.16 37.59,-1.91 -2.41,-1.91
GND on Bottom Layer: -1.91,18.92 36.7,18.92 36.7,-1.4 -1.91,-1.4
VBUS on Top Layer: 24,5.59 29.08,5.59 29.08,0.89 24,0.89
BAT on Top Layer: 1.14,8.89 8.38,8.89 8.38,3.56 1.14,3.56
BAT-O on Top Layer: 0.87,11.56 12.83,11.56 12.83,5.59 0.87,5.59
L2_2 on Top Layer: 5.59,15.49 15.49,15.49 15.49,9.57 5.59,9.57

## Text on the board
Bottom Silkscreen Layer: + | U+
